# EAGLE schematic giraffe_20 (EAGLE 8.3.1)
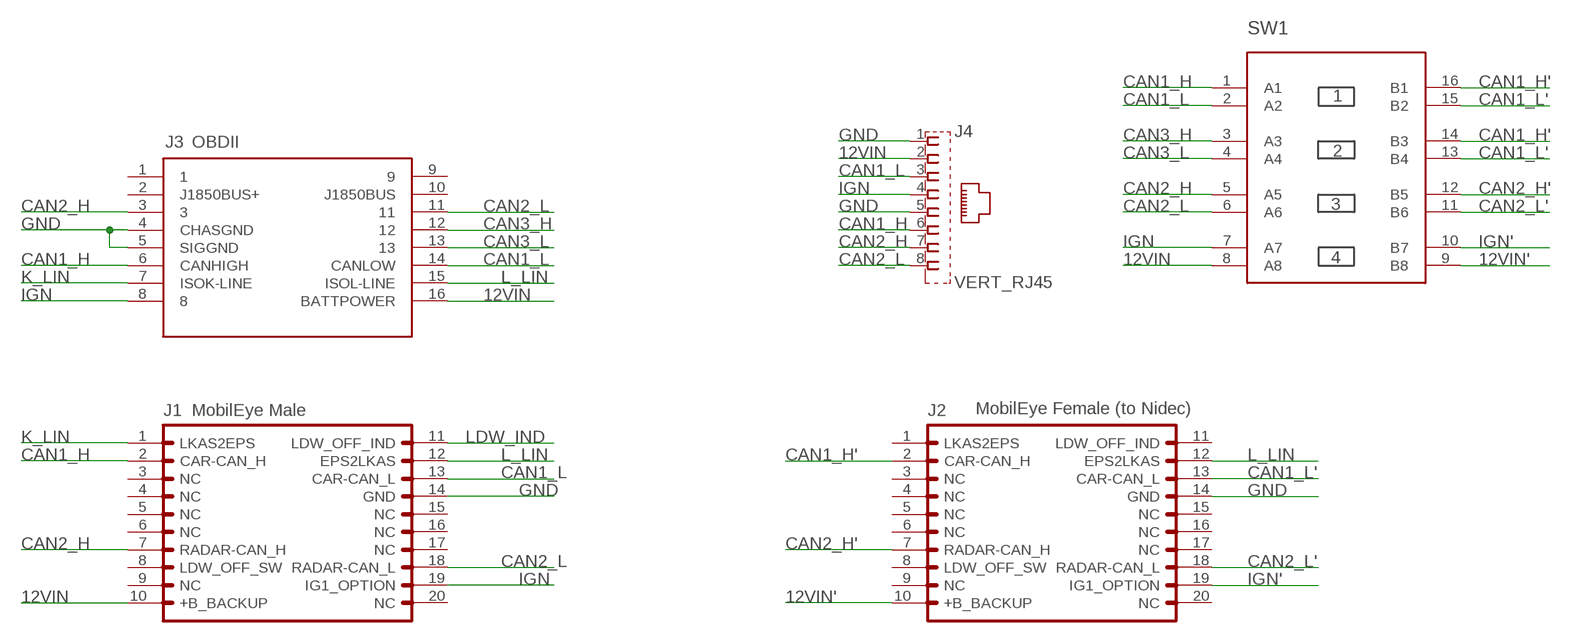
[diagram p0: schematic, sheet 1]

## Parts
J1  MOBILEYERAMALE  [2X10(RA)]
J2  MOBILEYEFEMALE  [2X10(JAE_FEMALE)]
J3  OBDIIFEMALE  [OBDII-FEMALE]
J4  VERT_RJ45  [GLX-S-88M]
SW1  4XDPSTSMT  [4-DPST]

## Nets
12VIN: J1.10(+B_BACKUP) J3.16(BATTPOWER) J4.2 SW1.8(A8)
12VIN': J2.10(+B_BACKUP) SW1.9(B8)
CAN1_H: J1.2(CAR-CAN_H) J3.6(CANHIGH) J4.6 SW1.1(A1)
CAN1_H': J2.2(CAR-CAN_H) SW1.14(B3) SW1.16(B1)
CAN1_L: J1.13(CAR-CAN_L) J3.14(CANLOW) J4.3 SW1.2(A2)
CAN1_L': J2.13(CAR-CAN_L) SW1.13(B4) SW1.15(B2)
CAN2_H: J1.7(RADAR-CAN_H) J3.3 J4.7 SW1.5(A5)
CAN2_H': J2.7(RADAR-CAN_H) SW1.12(B5)
CAN2_L: J1.18(RADAR-CAN_L) J3.11 J4.8 SW1.6(A6)
CAN2_L': J2.18(RADAR-CAN_L) SW1.11(B6)
CAN3_H: J3.12 SW1.3(A3)
CAN3_L: J3.13 SW1.4(A4)
GND: J1.14(GND) J2.14(GND) J3.4(CHASGND) J3.5(SIGGND) J4.1 J4.5
IGN: J1.19(IG1_OPTION) J3.8 J4.4 SW1.7(A7)
IGN': J2.19(IG1_OPTION) SW1.10(B7)
K_LIN: J1.1(LKAS2EPS) J3.7(ISOK-LINE)
L_LIN: J1.12(EPS2LKAS) J2.12(EPS2LKAS) J3.15(ISOL-LINE)
LDW_IND: J1.11(LDW_OFF_IND)
Unconnected: J1.3(NC) J1.4(NC) J1.5(NC) J1.6(NC) J1.8(LDW_OFF_SW) J1.9(NC) J1.15(NC) J1.16(NC) J1.17(NC) J1.20(NC) J2.1(LKAS2EPS) J2.3(NC) J2.4(NC) J2.5(NC) J2.6(NC) J2.8(LDW_OFF_SW) J2.9(NC) J2.11(LDW_OFF_IND) J2.15(NC) J2.16(NC) J2.17(NC) J2.20(NC) J3.1 J3.2(J1850BUS+) J3.9 J3.10(J1850BUS)

## Notes on the sheet
- OBDII
- MobilEye Male | MobilEye Female (to Nidec)

## Library data of the parts
J1 J2 = comma.ai:MOBILEYE: MobileEye connector for Acura ILX
J3 = comma.ai:OBDII: OBDII connector footprint
J4 = comma.ai:VERT_RJ45: Mod. Jack, Right Angle, 8 posiotion, 8 contatcs RJ45 Source: GLX-S-88M.pdf; OC_FARNELL: unknown; OC_NEWARK: unknown
SW1 = comma.ai:4XDPST

## Net classes
1 data: width 0.254 mm, clearance 0.254 mm